# Altium schematic sheet Teensywpinsfinal.SchDoc
size C
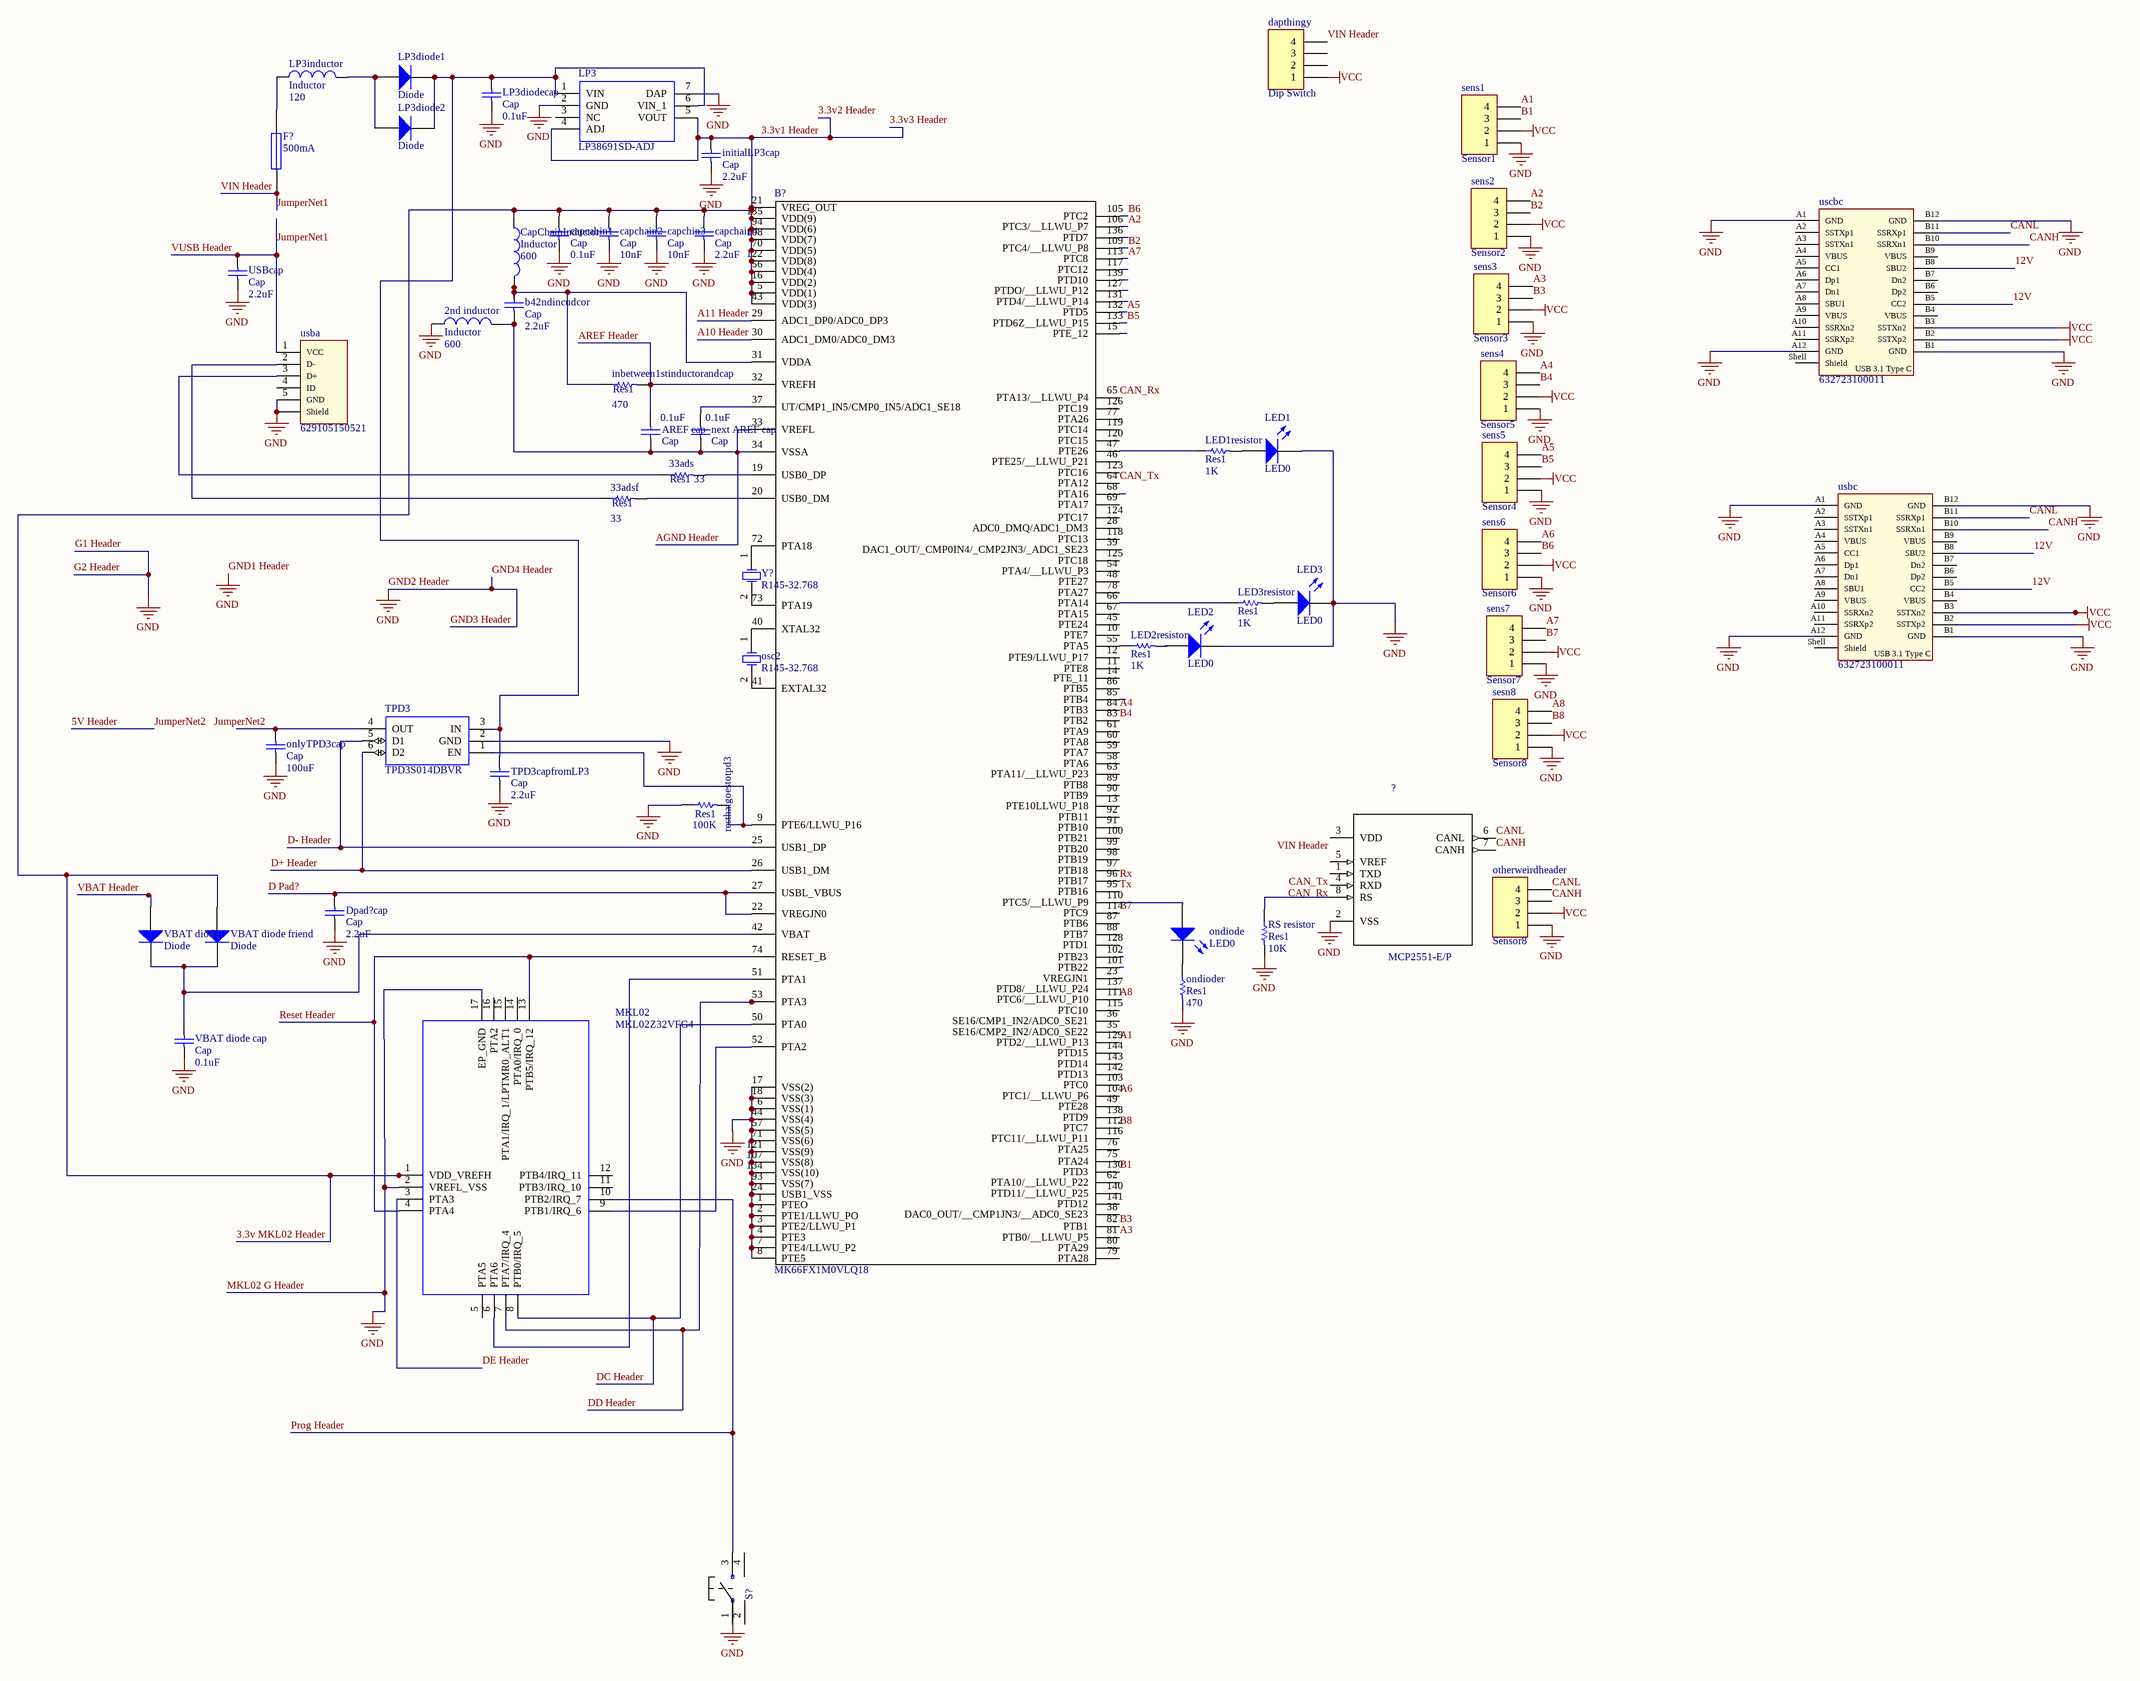
[diagram p0: Teensywpinsfinal.SchDoc]

## Parts
2nd_inductor  Inductor  value 600  [INDC5041X06N]
33ads  Res1  value 33  [CAPC1005X06N]
33adsf  Res1  value 33  [CAPC1005X06N]
?  MCP2551-E/P  [SOIC127P600X175-8N]
AREF_cap  Cap  value 0.1uF  [INDC2012X06N]
b42ndincudcor  Cap  value 2.2uF  [INDC2012X06N]
B?  MK66FX1M0VLQ18  [QFP50P2200X2200X160-144N]
capcahin1  Cap  value 0.1uF  [INDC2012X06N]
capchain2  Cap  value 10nF  [INDC2012X06N]
capchain4  Cap  value 2.2uF  [INDC2012X06N]
CapChainInductor  Inductor  value 600  [INDC5041X06N]
capchin3  Cap  value 10nF  [INDC2012X06N]
dapthingy  Dip Switch  [SOP254P1020X947-4N]
Dpad?cap  Cap  value 2.2uF  [INDC2012X06N]
F?  500mA  [CAPC1608X06N]
inbetween1stinductorandcap  Res1  value 470  [CAPC1005X06N]
initialLP3cap  Cap  value 2.2uF  [INDC2012X06N]
LED1  LED0  [0603]
LED1resistor  Res1  value 1K  [CAPC1005X04N]
LED2  LED0  [0603]
LED2resistor  Res1  value 1K  [CAPC1005X04N]
LED3  LED0  [0603]
LED3resistor  Res1  value 1K  [CAPC1005X04N]
LP3  LP38691SD-ADJ  [SON95P300X300X80-7N]
LP3diode1  Diode  [SODFL370X105-2N]
LP3diode2  Diode  [SODFL370X105-2N]
LP3diodecap  Cap  value 0.1uF  [INDC2012X06N]
LP3inductor  Inductor  value 120  [CAPC1608X06N]
MKL02  MKL02Z32VFG4  [QFN50P300X300X65-17N-D]
next_AREF_cap  Cap  value 0.1uF  [INDC2012X06N]
ondiode  LED0  [0603]
ondioder  Res1  value 470  [CAPC1005X06N]
onlyTPD3cap  Cap  value 100uF  [INDC3225X06N]
osc2  R145-32.768  [R145]
otherweirdheader  Sensor8  [HDR1X4]
resthatgoestotpd3  Res1  value 100K  [CAPC1005X06N]
RS_resistor  Res1  value 10K  [CAPC1005X04N]
S?  TL3315NF100Q  [TL3315NF100Q]  (value not drawn)
sens1  Sensor1  [HDR1X4]
sens2  Sensor2  [HDR1X4]
sens3  Sensor3  [HDR1X4]
sens4  Sensor5  [HDR1X4]
sens5  Sensor4  [HDR1X4]
sens6  Sensor6  [HDR1X4]
sens7  Sensor7  [HDR1X4]
sesn8  Sensor8  [HDR1X4]
TPD3  TPD3S014DBVR  [SOT95P280X145-6N]
TPD3capfromLP3  Cap  value 2.2uF  [INDC2012X06N]
usba  629105150521  [629105150521]
usbc  632723100011  [632723100011]
USBcap  Cap  value 2.2uF  [INDC2012X06N]
uscbc  632723100011  [632723100011]
VBAT_diode  Diode  [SODFL370X105-2N]
VBAT_diode_cap  Cap  value 0.1uF  [INDC2012X06N]
VBAT_diode_friend  Diode  [SODFL370X105-2N]
Y?  R145-32.768  [R145]

## Nets
G1 Header: 2nd_inductor.1 ?.2(VSS) B?.1(PTEO) B?.2(PTE1/LLWU_PO) B?.3(PTE2/LLWU_P1) B?.4(PTE3) B?.6(VSS(1)) B?.7(PTE4/LLWU_P2) B?.8(PTE5) B?.17(VSS(2)) B?.18(VSS(3)) B?.24(USB1_VSS) B?.44(VSS(4)) B?.57(VSS(5)) B?.71(VSS(6)) B?.93(VSS(7)) B?.107(VSS(8)) B?.121(VSS(9)) B?.134(VSS(10)) capcahin1.2 capchain2.2 capchain4.2 capchin3.2 Dpad?cap.2 initialLP3cap.2 LED1.2(K) LED2.2(K) LED3.2(K) LP3.2(GND) LP3.7(DAP) LP3diodecap.2 MKL02.2(VREFL_VSS) MKL02.17(EP_GND) ondioder.2 onlyTPD3cap.2 otherweirdheader.1 resthatgoestotpd3.1 RS_resistor.2 S?.1(P$1) sens1.1 sens2.1 sens3.1 sens4.1 sens5.1 sens6.1 sens7.1 sesn8.1 TPD3.2(GND) TPD3capfromLP3.2 usba.5(GND) usba.Shell(Shield) usbc.A1(GND) usbc.A12(GND) usbc.B1(GND) usbc.B12(GND) USBcap.2 uscbc.A1(GND) uscbc.A12(GND) uscbc.B1(GND) uscbc.B12(GND) VBAT_diode_cap.2  [also labelled G2 Header, GND, GND1 Header, GND2 Header, GND3 Header, GND4 Header, MKL02 G Header]
VCC: dapthingy.1 otherweirdheader.2 sens1.2 sens2.2 sens3.2 sens4.2 sens5.2 sens6.2 sens7.2 sesn8.2 usbc.B2(SSTXp2) usbc.B3(SSTXn2) uscbc.B2(SSTXp2) uscbc.B3(SSTXn2)
3.3v MKL02 Header: B?.5(VDD(1)) B?.16(VDD(2)) B?.21(VREG_OUT) B?.43(VDD(3)) B?.56(VDD(4)) B?.70(VDD(5)) B?.94(VDD(6)) B?.108(VDD(7)) B?.122(VDD(8)) B?.135(VDD(9)) capcahin1.1 capchain2.1 capchain4.1 CapChainInductor.1 capchin3.1 initialLP3cap.1 LP3.4(ADJ) LP3.5(VOUT) MKL02.1(VDD_VREFH) VBAT_diode_friend.1(A)  [also labelled 3.3v1 Header, 3.3v2 Header, 3.3v3 Header]
12V: usbc.B5(CC2) usbc.B8(SBU2) uscbc.B5(CC2) uscbc.B8(SBU2)
A1: B?.129(PTD2/__LLWU_P13) sens1.4
A2: B?.106(PTC3/__LLWU_P7) sens2.4
A3: B?.81(PTB0/__LLWU_P5) sens3.4
A4: B?.84(PTB3) sens4.4
A5: B?.132(PTD5) sens5.4
A6: B?.104(PTC1/__LLWU_P6) sens6.4
A7: B?.113(PTC8) sens7.4
A8: B?.111(PTC6/__LLWU_P10) sesn8.4
A10 Header: B?.30(ADC1_DM0/ADC0_DM3)
A11 Header: B?.29(ADC1_DP0/ADC0_DP3)
AGND Header: 2nd_inductor.2 AREF_cap.2 b42ndincudcor.2 B?.33(VREFL) B?.34(VSSA) next_AREF_cap.2
AREF Header: AREF_cap.1 B?.32(VREFH) inbetween1stinductorandcap.2
B1: B?.130(PTD3) sens1.3
B2: B?.109(PTC4/__LLWU_P8) sens2.3
B3: B?.82(PTB1) sens3.3
B4: B?.83(PTB2) sens4.3
B5: B?.133(PTD6Z__LLWU_P15) sens5.3
B6: B?.105(PTC2) sens6.3
B7: B?.114(PTC9) sens7.3
B8: B?.112(PTC7) sesn8.3
CAN_Rx: ?.4(RXD) B?.65(PTA13/__LLWU_P4)
CAN_Tx: ?.1(TXD) B?.64(PTA12)
CANH: ?.7(CANH) otherweirdheader.3 usbc.B10(SSRXn1) uscbc.B10(SSRXn1)
CANL: ?.6(CANL) otherweirdheader.4 usbc.B11(SSRXp1) uscbc.B11(SSRXp1)
D Pad?: B?.22(VREGJN0) B?.27(USBL_VBUS) Dpad?cap.1
D+ Header: B?.26(USB1_DM) TPD3.6(D2)
D- Header: B?.25(USB1_DP) TPD3.5(D1)
DC Header: B?.50(PTA0) MKL02.8(PTB0/IRQ_5)
DD Header: B?.53(PTA3) MKL02.7(PTA7/IRQ_4)
DE Header: MKL02.3(PTA3)
JumperNet1: ?.3(VDD) dapthingy.4 F?.1 usba.1(VCC) USBcap.1  [also labelled VIN Header, VUSB Header]
Prog Header: MKL02.10(PTB2/IRQ_7) S?.3(P$2)
Reset Header: B?.74(RESET_B) MKL02.4(PTA4) MKL02.13(PTB5/IRQ_12)
Rx: B?.96(PTB17)
Tx: B?.95(PTB16)
VBAT Header: VBAT_diode.1(A)
Net33ads_1: 33ads.1 usba.3(D+)
Net33ads_2: 33ads.2 B?.19(USB0_DP)
Net33adsf_1: 33adsf.1 usba.2(D-)
Net33adsf_2: 33adsf.2 B?.20(USB0_DM)
Net?_8: ?.8(RS) RS_resistor.1
Netb42ndincudcor_1: b42ndincudcor.1 B?.31(VDDA) CapChainInductor.2 inbetween1stinductorandcap.1
NetB?_9: B?.9(PTE6/LLWU_P16) resthatgoestotpd3.2 TPD3.1(EN)
NetB?_37: B?.37(UT/CMP1_IN5/CMP0_IN5/ADC1_SE18) next_AREF_cap.1
NetB?_40: B?.40(XTAL32) osc2.1(OSC1)
NetB?_41: B?.41(EXTAL32) osc2.2(OSC2)
NetB?_42: B?.42(VBAT) VBAT_diode.2(K) VBAT_diode_cap.1 VBAT_diode_friend.2(K)
NetB?_47: B?.47(PTE26) LED1resistor.1
NetB?_51: B?.51(PTA1) MKL02.6(PTA6)
NetB?_52: B?.52(PTA2) MKL02.9(PTB1/IRQ_6)
NetB?_55: B?.55(PTA5) LED2resistor.1
NetB?_66: B?.66(PTA14) LED3resistor.1
NetB?_72: B?.72(PTA18) Y?.1(OSC1)
NetB?_73: B?.73(PTA19) Y?.2(OSC2)
NetB?_110: B?.110(PTC5/__LLWU_P9) ondiode.1(A)
NetF?_2: F?.2 LP3inductor.1
NetLED1_1: LED1.1(A) LED1resistor.2
NetLED2_1: LED2.1(A) LED2resistor.2
NetLED3_1: LED3.1(A) LED3resistor.2
NetLP3_1: LP3.1(VIN) LP3.6(VIN_1) LP3diode1.2(K) LP3diode2.2(K) LP3diodecap.1 TPD3.3(IN) TPD3capfromLP3.1
NetLP3diode1_1: LP3diode1.1(A) LP3diode2.1(A) LP3inductor.2
Netondiode_2: ondiode.2(K) ondioder.1
NetonlyTPD3cap_1: onlyTPD3cap.1 TPD3.4(OUT)

Not connected (* = marked no-connect by the designer): ? 5(VREF); B? 10(PTE7) 11(PTE8) 12(PTE9/LLWU_P17) 13(PTE10LLWU_P18) 14(PTE_11) 15(PTE_12) 23(VREGJN1) 28(ADC0_DMQ/ADC1_DM3) 35(SE16/CMP2_IN2/ADC0_SE22) 36(SE16/CMP1_IN2/ADC0_SE21) 38(DAC0_OUT/__CMP1JN3/__ADC0_SE23) 39(DAC1_OUT/_CMP0IN4/_CMP2JN3/_ADC1_SE23) 45(PTE24) 46(PTE25/__LLWU_P21) 48(PTE27) 49(PTE28) 54(PTA4/__LLWU_P3) 58(PTA6) 59(PTA7) 60(PTA8) 61(PTA9) 62(PTA10/__LLWU_P22) 63(PTA11/__LLWU_P23) 67(PTA15) 68(PTA16) 69(PTA17) 75(PTA24) 76(PTA25) 77(PTA26) 78(PTA27) 79(PTA28) 80(PTA29) 85(PTB4) 86(PTB5) 87(PTB6) 88(PTB7) 89(PTB8) 90(PTB9) 91(PTB10) 92(PTB11) 97(PTB18) 98(PTB19) 99(PTB20) 100(PTB21) 101(PTB22) 102(PTB23) 103(PTC0) 115(PTC10) 116(PTC11/__LLWU_P11) 117(PTC12) 118(PTC13) 119(PTC14) 120(PTC15) 123(PTC16) 124(PTC17) 125(PTC18) 126(PTC19) 127(PTDO/__LLWU_P12) 128(PTD1) 131(PTD4/__LLWU_P14) 136(PTD7) 137(PTD8/__LLWU_P24) 138(PTD9) 139(PTD10) 140(PTD11/__LLWU_P25) 141(PTD12) 142(PTD13) 143(PTD14) 144(PTD15); dapthingy 2 3; LP3 3(NC); MKL02 5(PTA5) 11(PTB3/IRQ_10) 12(PTB4/IRQ_11) 14(PTA0/IRQ_0) 15(PTA1/IRQ_1/LPTMR0_ALT1) 16(PTA2); S? 2(P$1) 4(P$2); usba 4(ID); usbc A2(SSTXp1) A3(SSTXn1) A4(VBUS) A5(CC1) A6(Dp1) A7(Dn1) A8(SBU1) A9(VBUS) A10(SSRXn2) A11(SSRXp2) B4(VBUS) B6(Dp2) B7(Dn2) B9(VBUS) Shell(Shield); uscbc A2(SSTXp1) A3(SSTXn1) A4(VBUS) A5(CC1) A6(Dp1) A7(Dn1) A8(SBU1) A9(VBUS) A10(SSRXn2) A11(SSRXp2) B4(VBUS) B6(Dp2) B7(Dn2) B9(VBUS) Shell(Shield)

## Notes on the sheet
- Labels drawn without touching a wire or pin: JumperNet2
- (in symbol 632723100011) USB 3.1 Type C

## Library data of the parts
2nd_inductor CapChainInductor LP3inductor = Inductor: Code_IEC: 1005; Published: 8-Jun-2000; LatestRevisionDate: 29-May-2009; LatestRevisionNote: IPC-7351 Footprint Added.; PackageReference: 0402-A; Publisher: Altium Limited; PackageDescription: Chip Inductor; Code_JEITA: 0402
33ads 33adsf inbetween1stinductorandcap LED1resistor LED2resistor LED3resistor ondioder resthatgoestotpd3 RS_resistor = Res1: Resistor; Published: 8-Jun-2000; LatestRevisionDate: 17-Jul-2002; LatestRevisionNote: Re-released for DXP Platform.; PackageReference: AXIAL-0.3; Publisher: Altium Limited; PackageDescription: Axial Device, Thru-Hole; 2 Leads; 0.3 in Pin Spacing
? = MCP2551-E/P: IC TRANSCEIVER CAN HI-SPD 8-DIP; MF: Microchip; Package: DIP-8 Microchip; MP: MCP2551-E/P; Availability: Good; Price: 1.03 USD; Value: *
AREF_cap b42ndincudcor capcahin1 capchain2 capchain4 capchin3 Dpad?cap initialLP3cap LP3diodecap next_AREF_cap onlyTPD3cap TPD3capfromLP3 USBcap VBAT_diode_cap = Cap: Capacitor; Published: 8-Jun-2000; LatestRevisionDate: 17-Jul-2002; LatestRevisionNote: Re-released for DXP Platform.; PackageReference: RAD-0.3; Publisher: Altium Limited; PackageDescription: Radial Cap, Thru-Hole; 2 Leads; 0.3 in Pin Spacing
B? = MK66FX1M0VLQ18: NXP - MK66FX1M0VLQ18 - MPU, ARM CORTEX-M4F, 180MHZ, LQFP-144; Manufacturer_Name: Nexperia; Geometry.Height: 1.6mm; Supplier_Name: RS; RS Part Number: *; Manufacturer_Part_Number: MK66FX1M0VLQ18; Allied_Number: *; Other Part Number: *; Datasheet Link: https://cache.nxp.com/docs/en/data-sheet/K66P144M180SF5V2.pdf; 3D Package: *
dapthingy otherweirdheader sens1-sens7 sesn8 = Header 4: Header, 4-Pin; LatestRevisionDate: 17-Jul-2002; LatestRevisionNote: Re-released for DXP Platform.; Publisher: Altium Limited
F? = Fuse 1: Fuse; Published: 8-Jun-2000; LatestRevisionDate: 17-Jul-2002; LatestRevisionNote: Re-released for DXP Platform.; PackageReference: PIN-W2/E2.8; Publisher: Altium Limited; PackageDescription: Thru-Hole; 2 Leads
LED1-LED3 ondiode = LED0: Typical INFRARED GaAs LED; Published: 8-Jun-2000; LatestRevisionDate: 08-Jul-2005; LatestRevisionNote: Mech Layer 1 removed.; PackageReference: LED-0; Publisher: Altium Limited; PackageDescription: LED; 2 Leads
LP3 = LP38691SD-ADJ: 500mA LDO Regulator Adj.,LP38691SD-ADJ; Manufacturer_Name: Texas Instruments; Geometry.Height: 0.8mm; Supplier_Name: Mouser; Mouser Part Number: 926-LP38691SD-ADJ; Manufacturer_Part_Number: LP38691SD-ADJ; Datasheet Link: http://www.ti.com/lit/ds/symlink/lp38691-adj.pdf; 3D Package: *
LP3diode1 LP3diode2 VBAT_diode VBAT_diode_friend = Diode: Default Diode; Published: 8-Jun-2000; LatestRevisionDate: 17-Jul-2002; LatestRevisionNote: Re-released for DXP Platform.; PackageVersion: Sep-1996; PackageReference: SMC; Publisher: Altium Limited; PackageDescription: DO-214-AB/SMC; 2 C-Bend Leads; Body 7.9 x 5.9 mm, inc. leads (LxW); Code_JEDEC: DO-214-AB
MKL02 = MKL02Z32VFG4: Freescale MKL02Z32VFG4, 32bit ARM Cortex M0 Microcontroller, 48MHz, 32 kB Flash, 16-Pin QFN; Manufacturer_Name: Nexperia; Geometry.Height: 0.65mm; Supplier_Name: RS; RS Part Number: 7884723; Manufacturer_Part_Number: MKL02Z32VFG4; Allied_Number: *; Other Part Number: *; Datasheet Link: http://cache.nxp.com/files/32bit/doc/data_sheet/KL02P32M48SF0.pdf; 3D Package: *
osc2 Y? = R145-32.768: Tuning Fork Crystal Unit; Published: 8-Jun-2000; LatestRevisionDate: 17-Jul-2002; LatestRevisionNote: Re-released for DXP Platform.; DatasheetDocument: 28-Sep-1998; PackageReference: R145; Publisher: Altium Limited; ComponentLink1Description: Manufacturer Link; ComponentLink1URL: http://www.raltron.com/products/microcrystals/default.asp; ComponentLink2Description: Datasheet; ComponentLink2URL: http://www.raltron.com/products/pdfspecs/crystal_r38_26_145.pdf
S? = TL3315NF100Q: SWITCH TACTILE SPST-NO 0.05A 15V; MF: E-Switch; Package: None; Availability: Good; Price: 0.13 USD; MP: TL3315NF100Q; Value: *
TPD3 = TPD3S014DBVR: Current Limit Load Sw & TVS 0.5A SOT23-6 Texas Instruments TPD3S014DBVR Load Switch IC, Current Limit Switch, 4.5  5.5V, 6-Pin, SOT-23; Geometry.Height: 1.45mm; Supplier_Name: RS; RS Part Number: 9009703P; Manufacturer_Name: Texas Instruments; Manufacturer_Part_Number: TPD3S014DBVR; Allied_Number: *; Other Part Number: *; Datasheet Link: http://www.ti.com/lit/ds/symlink/tpd3s044.pdf; 3D Package: *
usba = 629105150521: Micro USB 2.0 SMT Type B Horizontal 5 Contacts High Current WR-COM; Interface Type: Type B; Gender: Receptacle; ComponentLink1Description: Manufacturer; ComponentLink1URL: http://www.we-online.de; ComponentLink2Description: Datasheet; ComponentLink2URL: http://katalog.we-online.de/em/datasheet/629105150521.pdf; Part Number: 629105150521; Published Date: April 2017; Publisher: Wurth Elektronik; Sub-Family: Micro USB 2.0; Type: Horizontal; Construction: SMT
usbc uscbc = 632723100011: USB 3.1 Type C Receptacle Horizontal THR WR-COM; Interface Type: Type C; Sub-Family: USB 3.1; ComponentLink1Description: Manufacturer; ComponentLink1URL: http://www.we-online.de; ComponentLink2Description: Datasheet; ComponentLink2URL: http://katalog.we-online.de/em/datasheet/632723x00011.pdf; Part Number: 632723100011; Published Date: April 2017; Publisher: Wurth Elektronik; Gender: Receptacle; Type: Horizontal; Construction: THR